# EAGLE design untitled (EAGLE 9.6.2)
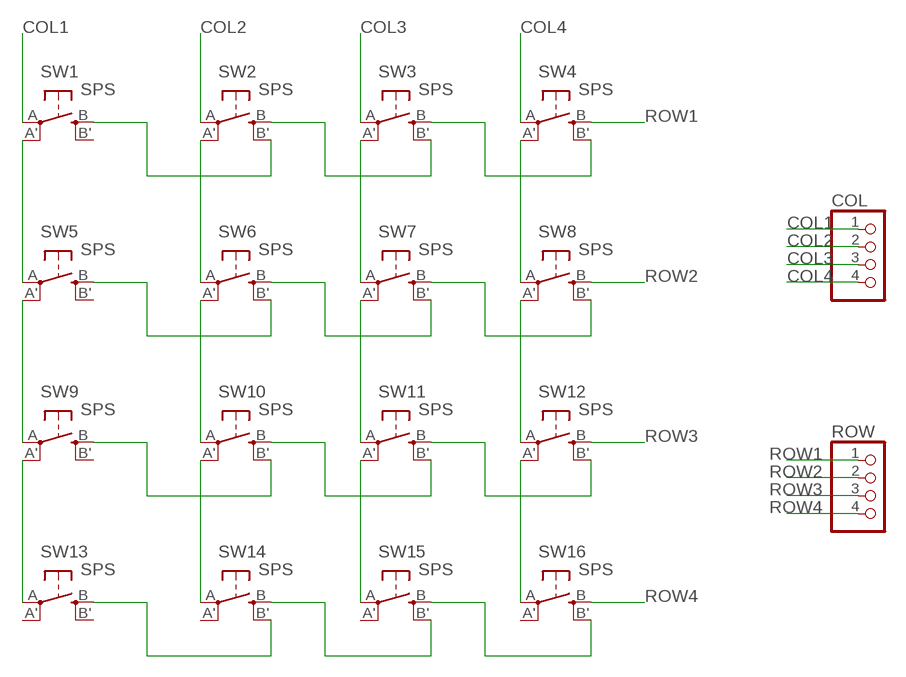
[diagram p0: schematic, sheet 1]

## Parts
COL  PINHD-1X4  [1X04]
ROW  PINHD-1X4  [1X04]
SW1  SPS  SPST_TACT-EVQQ2  [EVQ-Q2]
SW2  SPS  SPST_TACT-EVQQ2  [EVQ-Q2]
SW3  SPS  SPST_TACT-EVQQ2  [EVQ-Q2]
SW4  SPS  SPST_TACT-EVQQ2  [EVQ-Q2]
SW5  SPS  SPST_TACT-EVQQ2  [EVQ-Q2]
SW6  SPS  SPST_TACT-EVQQ2  [EVQ-Q2]
SW7  SPS  SPST_TACT-EVQQ2  [EVQ-Q2]
SW8  SPS  SPST_TACT-EVQQ2  [EVQ-Q2]
SW9  SPS  SPST_TACT-EVQQ2  [EVQ-Q2]
SW10  SPS  SPST_TACT-EVQQ2  [EVQ-Q2]
SW11  SPS  SPST_TACT-EVQQ2  [EVQ-Q2]
SW12  SPS  SPST_TACT-EVQQ2  [EVQ-Q2]
SW13  SPS  SPST_TACT-EVQQ2  [EVQ-Q2]
SW14  SPS  SPST_TACT-EVQQ2  [EVQ-Q2]
SW15  SPS  SPST_TACT-EVQQ2  [EVQ-Q2]
SW16  SPS  SPST_TACT-EVQQ2  [EVQ-Q2]

## Nets
COL1: COL.1 SW1.A(P)
COL2: COL.2 SW2.A(P)
COL3: COL.3 SW3.A(P)
COL4: COL.4 SW4.A(P)
N$2: SW1.A'(P1) SW5.A(P)
N$3: SW5.A'(P1) SW9.A(P)
N$4: SW9.A'(P1) SW13.A(P)
N$6: SW2.A'(P1) SW6.A(P)
N$7: SW6.A'(P1) SW10.A(P)
N$8: SW10.A'(P1) SW14.A(P)
N$10: SW3.A'(P1) SW7.A(P)
N$11: SW7.A'(P1) SW11.A(P)
N$12: SW11.A'(P1) SW15.A(P)
N$14: SW4.A'(P1) SW8.A(P)
N$15: SW8.A'(P1) SW12.A(P)
N$16: SW12.A'(P1) SW16.A(P)
N$17: SW1.B(S) SW2.B'(S1)
N$18: SW2.B(S) SW3.B'(S1)
N$19: SW3.B(S) SW4.B'(S1)
N$20: SW5.B(S) SW6.B'(S1)
N$21: SW6.B(S) SW7.B'(S1)
N$22: SW7.B(S) SW8.B'(S1)
N$23: SW9.B(S) SW10.B'(S1)
N$24: SW10.B(S) SW11.B'(S1)
N$25: SW11.B(S) SW12.B'(S1)
N$26: SW13.B(S) SW14.B'(S1)
N$27: SW14.B(S) SW15.B'(S1)
N$28: SW15.B(S) SW16.B'(S1)
ROW1: ROW.1 SW4.B(S)
ROW2: ROW.2 SW8.B(S)
ROW3: ROW.3 SW12.B(S)
ROW4: ROW.4 SW16.B(S)
Unconnected: SW1.B'(S1) SW5.B'(S1) SW9.B'(S1) SW13.A'(P1) SW13.B'(S1) SW14.A'(P1) SW15.A'(P1) SW16.A'(P1)

## Library data of the parts
COL ROW = pinhead:PINHD-1X4: PIN HEADER
SW1-SW16 = adafruit:SPST_TACT: SMT 6mm switch, EVQQ2 series http://www.ladyada.net/library/eagle

## Board
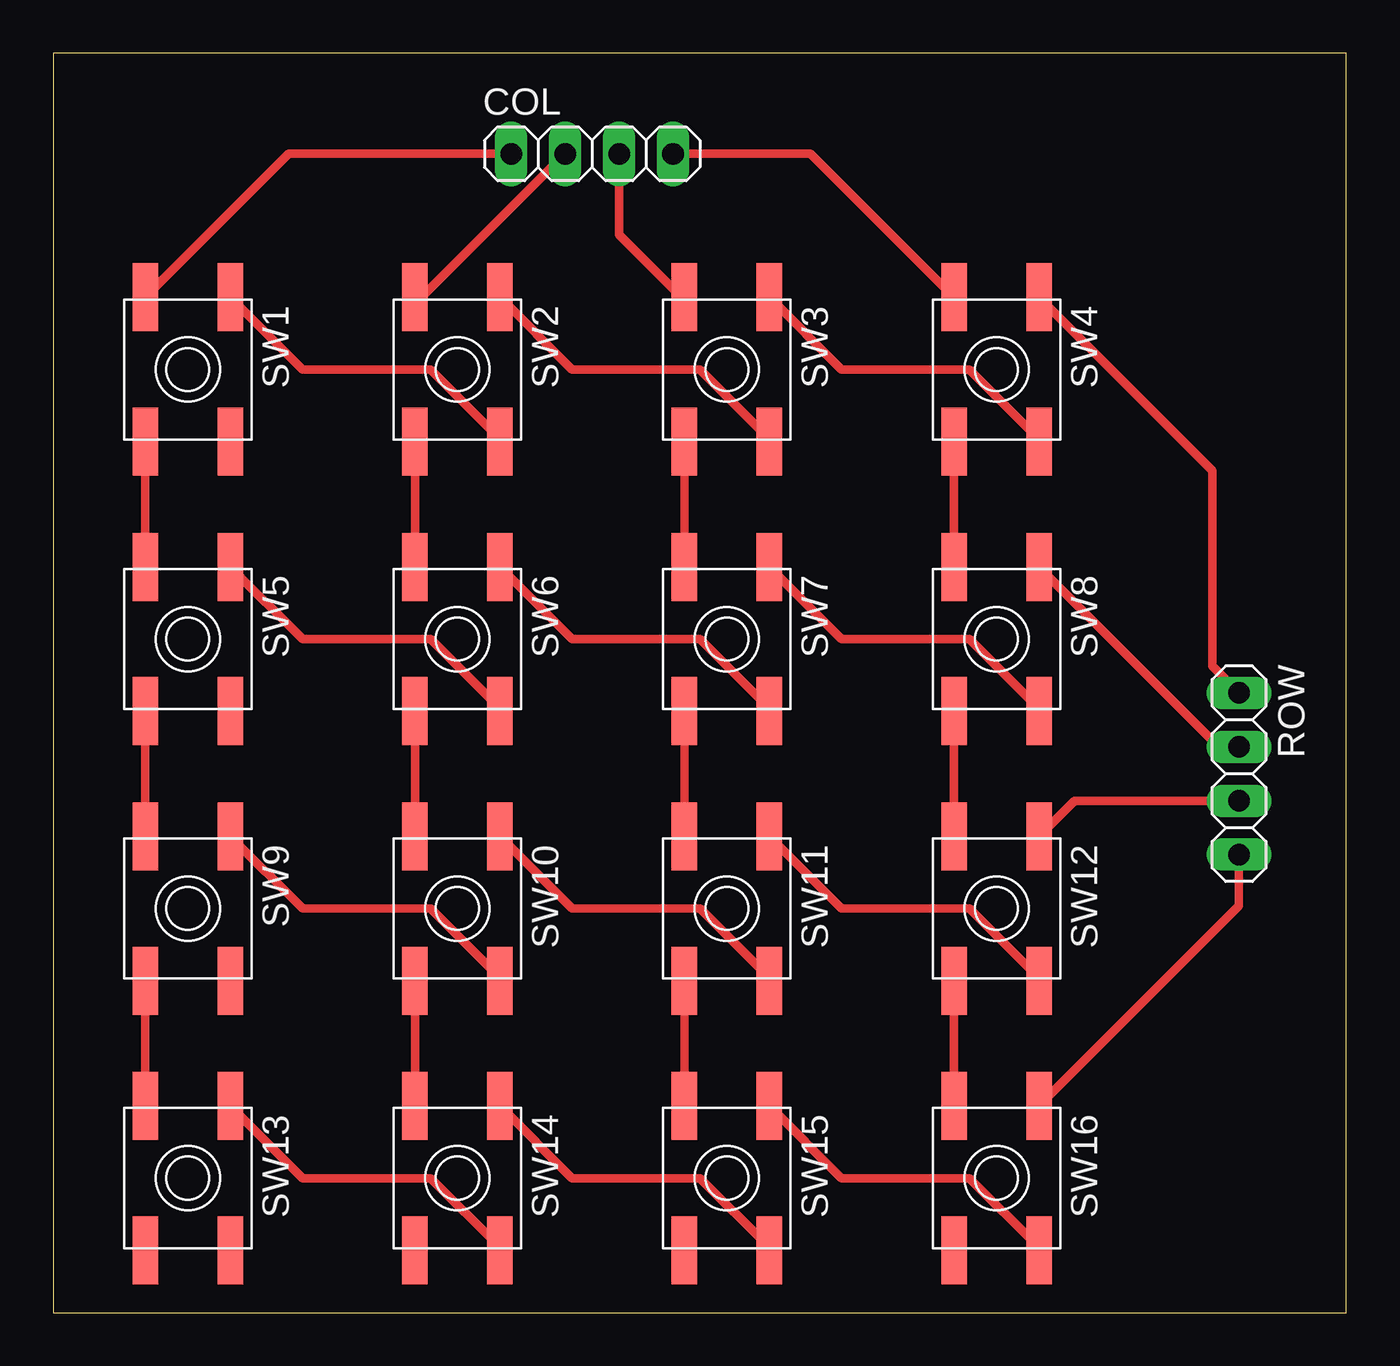
[diagram p1: board, top side]

Size 60.94 x 59.36 mm. Coordinates in mm from the lower left corner, seen from the top.
Outline: 0,0 60.94,0 60.94,59.36 0,59.36 0,0
Copper layers (1*16): Top 0.035mm / dielectric 1.5mm / Bottom 0.035mm
Design rules "default": minimum track width 6mil, minimum drill 0.35mm, track to track 6mil, track to pad 6mil, pad to pad 6mil, via to via 6mil, smd to smd 6mil, copper to edge 40mil, drill to drill 6mil, minimum pad ring 10mil, minimum via ring 8mil, stop-mask expansion 4mil, vias tented up to drill 0mil, thermal gap 10mil

### Footprints (pad centres in the part's own frame; a part is rotated, then mirrored left to right if it is on the bottom)
1X04 = drill 1.016 long: 1 -3.81,0; 2 -1.27,0; 3 1.27,0; 4 3.81,0
EVQ-Q2 = smd 3.2 x 1.2: A -3.4,-2; A' 3.4,-2; B -3.4,2; B' 3.4,2

### Placement (x,y rotation side)
COL  25.4,54.61 0 top
ROW  55.88,25.4 270 top
SW1  6.35,44.45 270 top
SW2  19.05,44.45 270 top
SW3  31.75,44.45 270 top
SW4  44.45,44.45 270 top
SW5  6.35,31.75 270 top
SW6  19.05,31.75 270 top
SW7  31.75,31.75 270 top
SW8  44.45,31.75 270 top
SW9  6.35,19.05 270 top
SW10  19.05,19.05 270 top
SW11  31.75,19.05 270 top
SW12  44.45,19.05 270 top
SW13  6.35,6.35 270 top
SW14  19.05,6.35 270 top
SW15  31.75,6.35 270 top
SW16  44.45,6.35 270 top

### Tracks (layer width: path | path; a pad name or v marks a point on that pad's centre or on a via)
COL1
  Top 0.406: SW1.A 11.11,54.61 COL.1
COL2
  Top 0.406: COL.2 17.37,47.85 SW2.A
COL3
  Top 0.406: COL.3 26.67,50.8 29.62,47.85 SW3.A
COL4
  Top 0.406: COL.4 35.69,54.61 SW4.A
N$2
  Top 0.406: SW5.A SW1.A'
N$3
  Top 0.406: SW9.A SW5.A'
N$4
  Top 0.406: SW13.A SW9.A'
N$6
  Top 0.406: SW2.A' SW6.A
N$7
  Top 0.406: SW6.A' SW10.A
N$8
  Top 0.406: SW10.A' SW14.A
N$10
  Top 0.406: SW3.A' SW7.A
N$11
  Top 0.406: SW7.A' SW11.A
N$12
  Top 0.406: SW11.A' SW15.A
N$14
  Top 0.406: SW8.A SW4.A'
N$15
  Top 0.406: SW12.A SW8.A'
N$16
  Top 0.406: SW16.A SW12.A'
N$17
  Top 0.406: SW1.B 11.75,44.45 17.78,44.45 21.05,41.18 SW2.B'
N$18
  Top 0.406: SW2.B 24.45,44.45 30.48,44.45 33.75,41.18 SW3.B'
N$19
  Top 0.406: SW3.B 37.15,44.45 43.18,44.45 46.45,41.18 SW4.B'
N$20
  Top 0.406: SW5.B 11.75,31.75 17.78,31.75 21.05,28.48 SW6.B'
N$21
  Top 0.406: SW6.B 24.45,31.75 30.48,31.75 33.75,28.48 SW7.B'
N$22
  Top 0.406: SW7.B 37.15,31.75 43.18,31.75 46.45,28.48 SW8.B'
N$23
  Top 0.406: SW9.B 11.75,19.05 17.78,19.05 21.05,15.78 SW10.B'
N$24
  Top 0.406: SW10.B 24.45,19.05 30.48,19.05 33.75,15.78 SW11.B'
N$25
  Top 0.406: SW11.B 37.15,19.05 43.18,19.05 46.45,15.78 SW12.B'
N$26
  Top 0.406: SW13.B 11.75,6.35 17.78,6.35 21.05,3.08 SW14.B'
N$27
  Top 0.406: SW14.B 24.45,6.35 30.48,6.35 33.75,3.08 SW15.B'
N$28
  Top 0.406: SW15.B 37.15,6.35 43.18,6.35 46.45,3.08 SW16.B'
ROW1
  Top 0.406: ROW.1 54.61,30.48 54.61,39.69 SW4.B
ROW2
  Top 0.406: ROW.2 54.93,26.67 SW8.B
ROW3
  Top 0.406: SW12.B 48.13,24.13 ROW.3
ROW4
  Top 0.406: ROW.4 55.88,19.18 SW16.B